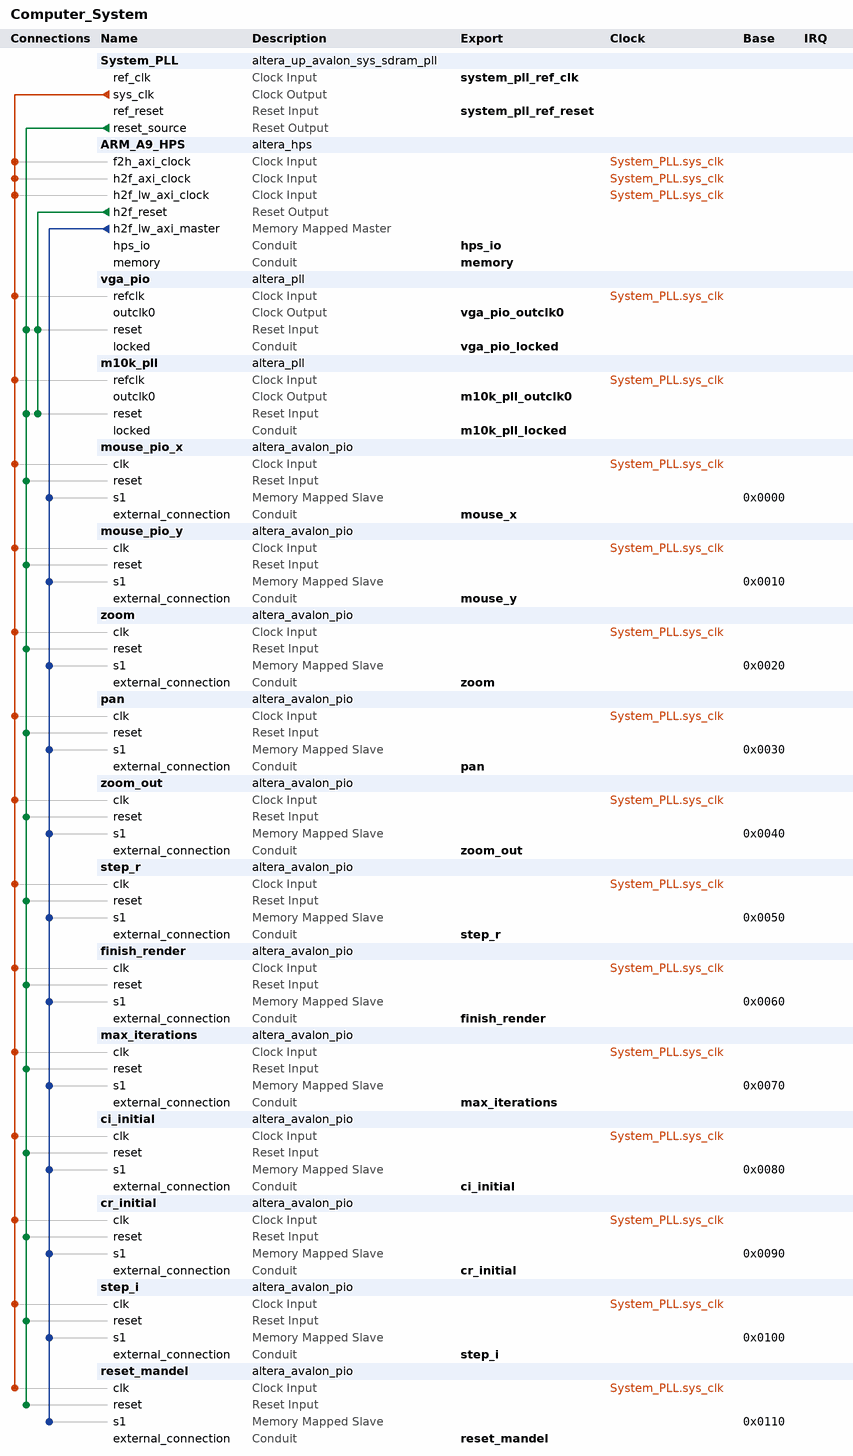
[diagram p0: system contents]
# Platform Designer (Qsys) system Computer_System, Cyclone V 5CSEMA5F31C6
# Parameters at their usual value, and those the tool derives, are not listed.
package require -exact qsys 18.1
create_system Computer_System
set_project_property DEVICE_FAMILY {Cyclone V}
set_project_property DEVICE 5CSEMA5F31C6

add_instance System_PLL altera_up_avalon_sys_sdram_pll 18.0
set_instance_parameter_value System_PLL CV_boards DE1-SoC
set_instance_parameter_value System_PLL gui_outclk 100.0
set_instance_parameter_value System_PLL gui_refclk 50.0

add_instance ARM_A9_HPS altera_hps 18.1
set_instance_parameter_value ARM_A9_HPS EMAC1_Mode RGMII
set_instance_parameter_value ARM_A9_HPS EMAC1_PinMuxing {HPS I/O Set 0}
set_instance_parameter_value ARM_A9_HPS F2SCLK_COLDRST_Enable false
set_instance_parameter_value ARM_A9_HPS F2SCLK_DBGRST_Enable false
set_instance_parameter_value ARM_A9_HPS F2SCLK_WARMRST_Enable false
set_instance_parameter_value ARM_A9_HPS F2SINTERRUPT_Enable true
set_instance_parameter_value ARM_A9_HPS F2S_Width 2
set_instance_parameter_value ARM_A9_HPS FPGA_PERIPHERAL_OUTPUT_CLOCK_FREQ_EMAC0_GTX_CLK 125
set_instance_parameter_value ARM_A9_HPS FPGA_PERIPHERAL_OUTPUT_CLOCK_FREQ_EMAC0_MD_CLK 100.0
set_instance_parameter_value ARM_A9_HPS FPGA_PERIPHERAL_OUTPUT_CLOCK_FREQ_EMAC1_GTX_CLK 125
set_instance_parameter_value ARM_A9_HPS FPGA_PERIPHERAL_OUTPUT_CLOCK_FREQ_EMAC1_MD_CLK 100.0
set_instance_parameter_value ARM_A9_HPS HPS_PROTOCOL DDR3
set_instance_parameter_value ARM_A9_HPS I2C0_Mode I2C
set_instance_parameter_value ARM_A9_HPS I2C0_PinMuxing {HPS I/O Set 0}
set_instance_parameter_value ARM_A9_HPS I2C1_Mode I2C
set_instance_parameter_value ARM_A9_HPS I2C1_PinMuxing {HPS I/O Set 0}
set_instance_parameter_value ARM_A9_HPS LWH2F_Enable true
set_instance_parameter_value ARM_A9_HPS MEM_BANKADDR_WIDTH 3
set_instance_parameter_value ARM_A9_HPS MEM_CLK_FREQ 400.0
set_instance_parameter_value ARM_A9_HPS MEM_COL_ADDR_WIDTH 10
set_instance_parameter_value ARM_A9_HPS MEM_DQ_WIDTH 32
set_instance_parameter_value ARM_A9_HPS MEM_DRV_STR RZQ/7
set_instance_parameter_value ARM_A9_HPS MEM_ROW_ADDR_WIDTH 15
set_instance_parameter_value ARM_A9_HPS MEM_RTT_NOM RZQ/4
set_instance_parameter_value ARM_A9_HPS MEM_RTT_WR RZQ/4
set_instance_parameter_value ARM_A9_HPS MEM_TCL 11
set_instance_parameter_value ARM_A9_HPS MEM_TFAW_NS 30.0
set_instance_parameter_value ARM_A9_HPS MEM_TRAS_NS 35.0
set_instance_parameter_value ARM_A9_HPS MEM_TRCD_NS 13.75
set_instance_parameter_value ARM_A9_HPS MEM_TRFC_NS 260.0
set_instance_parameter_value ARM_A9_HPS MEM_TRP_NS 13.75
set_instance_parameter_value ARM_A9_HPS MEM_VENDOR JEDEC
set_instance_parameter_value ARM_A9_HPS MEM_WTCL 8
set_instance_parameter_value ARM_A9_HPS QSPI_Mode {1 SS}
set_instance_parameter_value ARM_A9_HPS QSPI_PinMuxing {HPS I/O Set 0}
set_instance_parameter_value ARM_A9_HPS REF_CLK_FREQ 25.0
set_instance_parameter_value ARM_A9_HPS S2FCLK_USER2CLK 5
set_instance_parameter_value ARM_A9_HPS S2F_Width 3
set_instance_parameter_value ARM_A9_HPS SDIO_Mode {4-bit Data}
set_instance_parameter_value ARM_A9_HPS SDIO_PinMuxing {HPS I/O Set 0}
set_instance_parameter_value ARM_A9_HPS SPIM1_Mode {Single Slave Select}
set_instance_parameter_value ARM_A9_HPS SPIM1_PinMuxing {HPS I/O Set 0}
set_instance_parameter_value ARM_A9_HPS STM_Enable false
set_instance_parameter_value ARM_A9_HPS TIMING_BOARD_AC_SKEW 0.03
set_instance_parameter_value ARM_A9_HPS TIMING_BOARD_AC_TO_CK_SKEW 0.0
set_instance_parameter_value ARM_A9_HPS TIMING_BOARD_DQ_TO_DQS_SKEW 0.0
set_instance_parameter_value ARM_A9_HPS TIMING_BOARD_MAX_CK_DELAY 0.03
set_instance_parameter_value ARM_A9_HPS TIMING_BOARD_MAX_DQS_DELAY 0.02
set_instance_parameter_value ARM_A9_HPS TIMING_BOARD_SKEW_BETWEEN_DQS 0.08
set_instance_parameter_value ARM_A9_HPS TIMING_BOARD_SKEW_CKDQS_DIMM_MAX 0.16
set_instance_parameter_value ARM_A9_HPS TIMING_BOARD_SKEW_CKDQS_DIMM_MIN 0.09
set_instance_parameter_value ARM_A9_HPS TIMING_BOARD_SKEW_WITHIN_DQS 0.01
set_instance_parameter_value ARM_A9_HPS TIMING_TDH 65
set_instance_parameter_value ARM_A9_HPS TIMING_TDQSCK 255
set_instance_parameter_value ARM_A9_HPS TIMING_TDQSQ 125
set_instance_parameter_value ARM_A9_HPS TIMING_TDS 30
set_instance_parameter_value ARM_A9_HPS TIMING_TIH 140
set_instance_parameter_value ARM_A9_HPS TIMING_TIS 180
set_instance_parameter_value ARM_A9_HPS TIMING_TQSH 0.4
set_instance_parameter_value ARM_A9_HPS UART0_Mode {No Flow Control}
set_instance_parameter_value ARM_A9_HPS UART0_PinMuxing {HPS I/O Set 0}
set_instance_parameter_value ARM_A9_HPS USB1_Mode SDR
set_instance_parameter_value ARM_A9_HPS USB1_PinMuxing {HPS I/O Set 0}
set_instance_parameter_value ARM_A9_HPS desired_cfg_clk_mhz 100.0
set_instance_parameter_value ARM_A9_HPS desired_qspi_clk_mhz 400.0

add_instance vga_pio altera_pll 18.1
set_instance_parameter_value vga_pio gui_device_speed_grade 2
set_instance_parameter_value vga_pio gui_number_of_clocks 1
set_instance_parameter_value vga_pio gui_operation_mode direct
set_instance_parameter_value vga_pio gui_output_clock_frequency0 25.0
set_instance_parameter_value vga_pio gui_pll_mode {Integer-N PLL}
set_instance_parameter_value vga_pio gui_reference_clock_frequency 100.0
set_instance_parameter_value vga_pio gui_use_locked true

add_instance m10k_pll altera_pll 18.1
set_instance_parameter_value m10k_pll gui_device_speed_grade 2
set_instance_parameter_value m10k_pll gui_number_of_clocks 1
set_instance_parameter_value m10k_pll gui_operation_mode direct
set_instance_parameter_value m10k_pll gui_output_clock_frequency0 100.0
set_instance_parameter_value m10k_pll gui_pll_mode {Integer-N PLL}
set_instance_parameter_value m10k_pll gui_reference_clock_frequency 100.0
set_instance_parameter_value m10k_pll gui_use_locked true

add_instance mouse_pio_x altera_avalon_pio 18.1
set_instance_parameter_value mouse_pio_x direction Output
set_instance_parameter_value mouse_pio_x width 32

add_instance mouse_pio_y altera_avalon_pio 18.1
set_instance_parameter_value mouse_pio_y direction Output
set_instance_parameter_value mouse_pio_y width 32

add_instance zoom altera_avalon_pio 18.1
set_instance_parameter_value zoom direction Output
set_instance_parameter_value zoom width 32

add_instance pan altera_avalon_pio 18.1
set_instance_parameter_value pan direction Output
set_instance_parameter_value pan width 32

add_instance zoom_out altera_avalon_pio 18.1
set_instance_parameter_value zoom_out direction Output
set_instance_parameter_value zoom_out width 32

add_instance step_r altera_avalon_pio 18.1
set_instance_parameter_value step_r direction Output
set_instance_parameter_value step_r width 32

add_instance finish_render altera_avalon_pio 18.1
set_instance_parameter_value finish_render direction Input
set_instance_parameter_value finish_render width 32

add_instance max_iterations altera_avalon_pio 18.1
set_instance_parameter_value max_iterations direction Output
set_instance_parameter_value max_iterations width 32

add_instance ci_initial altera_avalon_pio 18.1
set_instance_parameter_value ci_initial direction Output
set_instance_parameter_value ci_initial width 32

add_instance cr_initial altera_avalon_pio 18.1
set_instance_parameter_value cr_initial direction Output
set_instance_parameter_value cr_initial width 32

add_instance step_i altera_avalon_pio 18.1
set_instance_parameter_value step_i direction Output
set_instance_parameter_value step_i width 32

add_instance reset_mandel altera_avalon_pio 18.1
set_instance_parameter_value reset_mandel direction Input
set_instance_parameter_value reset_mandel width 32

# connections
add_connection System_PLL.sys_clk ARM_A9_HPS.f2h_axi_clock clock
add_connection System_PLL.sys_clk ARM_A9_HPS.h2f_axi_clock clock
add_connection System_PLL.sys_clk ARM_A9_HPS.h2f_lw_axi_clock clock
add_connection System_PLL.sys_clk ci_initial.clk clock
add_connection System_PLL.sys_clk cr_initial.clk clock
add_connection System_PLL.sys_clk finish_render.clk clock
add_connection System_PLL.sys_clk m10k_pll.refclk clock
add_connection System_PLL.sys_clk max_iterations.clk clock
add_connection System_PLL.sys_clk mouse_pio_x.clk clock
add_connection System_PLL.sys_clk mouse_pio_y.clk clock
add_connection System_PLL.sys_clk pan.clk clock
add_connection System_PLL.sys_clk reset_mandel.clk clock
add_connection System_PLL.sys_clk step_i.clk clock
add_connection System_PLL.sys_clk step_r.clk clock
add_connection System_PLL.sys_clk vga_pio.refclk clock
add_connection System_PLL.sys_clk zoom.clk clock
add_connection System_PLL.sys_clk zoom_out.clk clock
add_connection ARM_A9_HPS.h2f_reset m10k_pll.reset reset
add_connection ARM_A9_HPS.h2f_reset vga_pio.reset reset
add_connection System_PLL.reset_source ci_initial.reset reset
add_connection System_PLL.reset_source cr_initial.reset reset
add_connection System_PLL.reset_source finish_render.reset reset
add_connection System_PLL.reset_source m10k_pll.reset reset
add_connection System_PLL.reset_source max_iterations.reset reset
add_connection System_PLL.reset_source mouse_pio_x.reset reset
add_connection System_PLL.reset_source mouse_pio_y.reset reset
add_connection System_PLL.reset_source pan.reset reset
add_connection System_PLL.reset_source reset_mandel.reset reset
add_connection System_PLL.reset_source step_i.reset reset
add_connection System_PLL.reset_source step_r.reset reset
add_connection System_PLL.reset_source vga_pio.reset reset
add_connection System_PLL.reset_source zoom.reset reset
add_connection System_PLL.reset_source zoom_out.reset reset
add_connection ARM_A9_HPS.h2f_lw_axi_master ci_initial.s1 avalon
set_connection_parameter_value ARM_A9_HPS.h2f_lw_axi_master/ci_initial.s1 baseAddress 0x0080
add_connection ARM_A9_HPS.h2f_lw_axi_master cr_initial.s1 avalon
set_connection_parameter_value ARM_A9_HPS.h2f_lw_axi_master/cr_initial.s1 baseAddress 0x0090
add_connection ARM_A9_HPS.h2f_lw_axi_master finish_render.s1 avalon
set_connection_parameter_value ARM_A9_HPS.h2f_lw_axi_master/finish_render.s1 baseAddress 0x0060
add_connection ARM_A9_HPS.h2f_lw_axi_master max_iterations.s1 avalon
set_connection_parameter_value ARM_A9_HPS.h2f_lw_axi_master/max_iterations.s1 baseAddress 0x0070
add_connection ARM_A9_HPS.h2f_lw_axi_master mouse_pio_x.s1 avalon
set_connection_parameter_value ARM_A9_HPS.h2f_lw_axi_master/mouse_pio_x.s1 baseAddress 0x0000
add_connection ARM_A9_HPS.h2f_lw_axi_master mouse_pio_y.s1 avalon
set_connection_parameter_value ARM_A9_HPS.h2f_lw_axi_master/mouse_pio_y.s1 baseAddress 0x0010
add_connection ARM_A9_HPS.h2f_lw_axi_master pan.s1 avalon
set_connection_parameter_value ARM_A9_HPS.h2f_lw_axi_master/pan.s1 baseAddress 0x0030
add_connection ARM_A9_HPS.h2f_lw_axi_master reset_mandel.s1 avalon
set_connection_parameter_value ARM_A9_HPS.h2f_lw_axi_master/reset_mandel.s1 baseAddress 0x0110
add_connection ARM_A9_HPS.h2f_lw_axi_master step_i.s1 avalon
set_connection_parameter_value ARM_A9_HPS.h2f_lw_axi_master/step_i.s1 baseAddress 0x0100
add_connection ARM_A9_HPS.h2f_lw_axi_master step_r.s1 avalon
set_connection_parameter_value ARM_A9_HPS.h2f_lw_axi_master/step_r.s1 baseAddress 0x0050
add_connection ARM_A9_HPS.h2f_lw_axi_master zoom.s1 avalon
set_connection_parameter_value ARM_A9_HPS.h2f_lw_axi_master/zoom.s1 baseAddress 0x0020
add_connection ARM_A9_HPS.h2f_lw_axi_master zoom_out.s1 avalon
set_connection_parameter_value ARM_A9_HPS.h2f_lw_axi_master/zoom_out.s1 baseAddress 0x0040

# exported interfaces
add_interface ci_initial conduit end
set_interface_property ci_initial EXPORT_OF ci_initial.external_connection
add_interface cr_initial conduit end
set_interface_property cr_initial EXPORT_OF cr_initial.external_connection
add_interface finish_render conduit end
set_interface_property finish_render EXPORT_OF finish_render.external_connection
add_interface hps_io conduit end
set_interface_property hps_io EXPORT_OF ARM_A9_HPS.hps_io
add_interface m10k_pll_locked conduit end
set_interface_property m10k_pll_locked EXPORT_OF m10k_pll.locked
add_interface m10k_pll_outclk0 clock source
set_interface_property m10k_pll_outclk0 EXPORT_OF m10k_pll.outclk0
add_interface max_iterations conduit end
set_interface_property max_iterations EXPORT_OF max_iterations.external_connection
add_interface memory conduit end
set_interface_property memory EXPORT_OF ARM_A9_HPS.memory
add_interface mouse_x conduit end
set_interface_property mouse_x EXPORT_OF mouse_pio_x.external_connection
add_interface mouse_y conduit end
set_interface_property mouse_y EXPORT_OF mouse_pio_y.external_connection
add_interface pan conduit end
set_interface_property pan EXPORT_OF pan.external_connection
add_interface reset_mandel conduit end
set_interface_property reset_mandel EXPORT_OF reset_mandel.external_connection
add_interface step_i conduit end
set_interface_property step_i EXPORT_OF step_i.external_connection
add_interface step_r conduit end
set_interface_property step_r EXPORT_OF step_r.external_connection
add_interface system_pll_ref_clk clock sink
set_interface_property system_pll_ref_clk EXPORT_OF System_PLL.ref_clk
add_interface system_pll_ref_reset reset sink
set_interface_property system_pll_ref_reset EXPORT_OF System_PLL.ref_reset
add_interface vga_pio_locked conduit end
set_interface_property vga_pio_locked EXPORT_OF vga_pio.locked
add_interface vga_pio_outclk0 clock source
set_interface_property vga_pio_outclk0 EXPORT_OF vga_pio.outclk0
add_interface zoom conduit end
set_interface_property zoom EXPORT_OF zoom.external_connection
add_interface zoom_out conduit end
set_interface_property zoom_out EXPORT_OF zoom_out.external_connection

set_interconnect_requirement {$system} qsys_mm.clockCrossingAdapter HANDSHAKE
set_interconnect_requirement {$system} qsys_mm.enableEccProtection FALSE
set_interconnect_requirement {$system} qsys_mm.insertDefaultSlave FALSE
set_interconnect_requirement {$system} qsys_mm.maxAdditionalLatency 1

save_system Computer_System.qsys
